# Altium project zynq_dev_V1.PrjPcb (part 1 of 3)
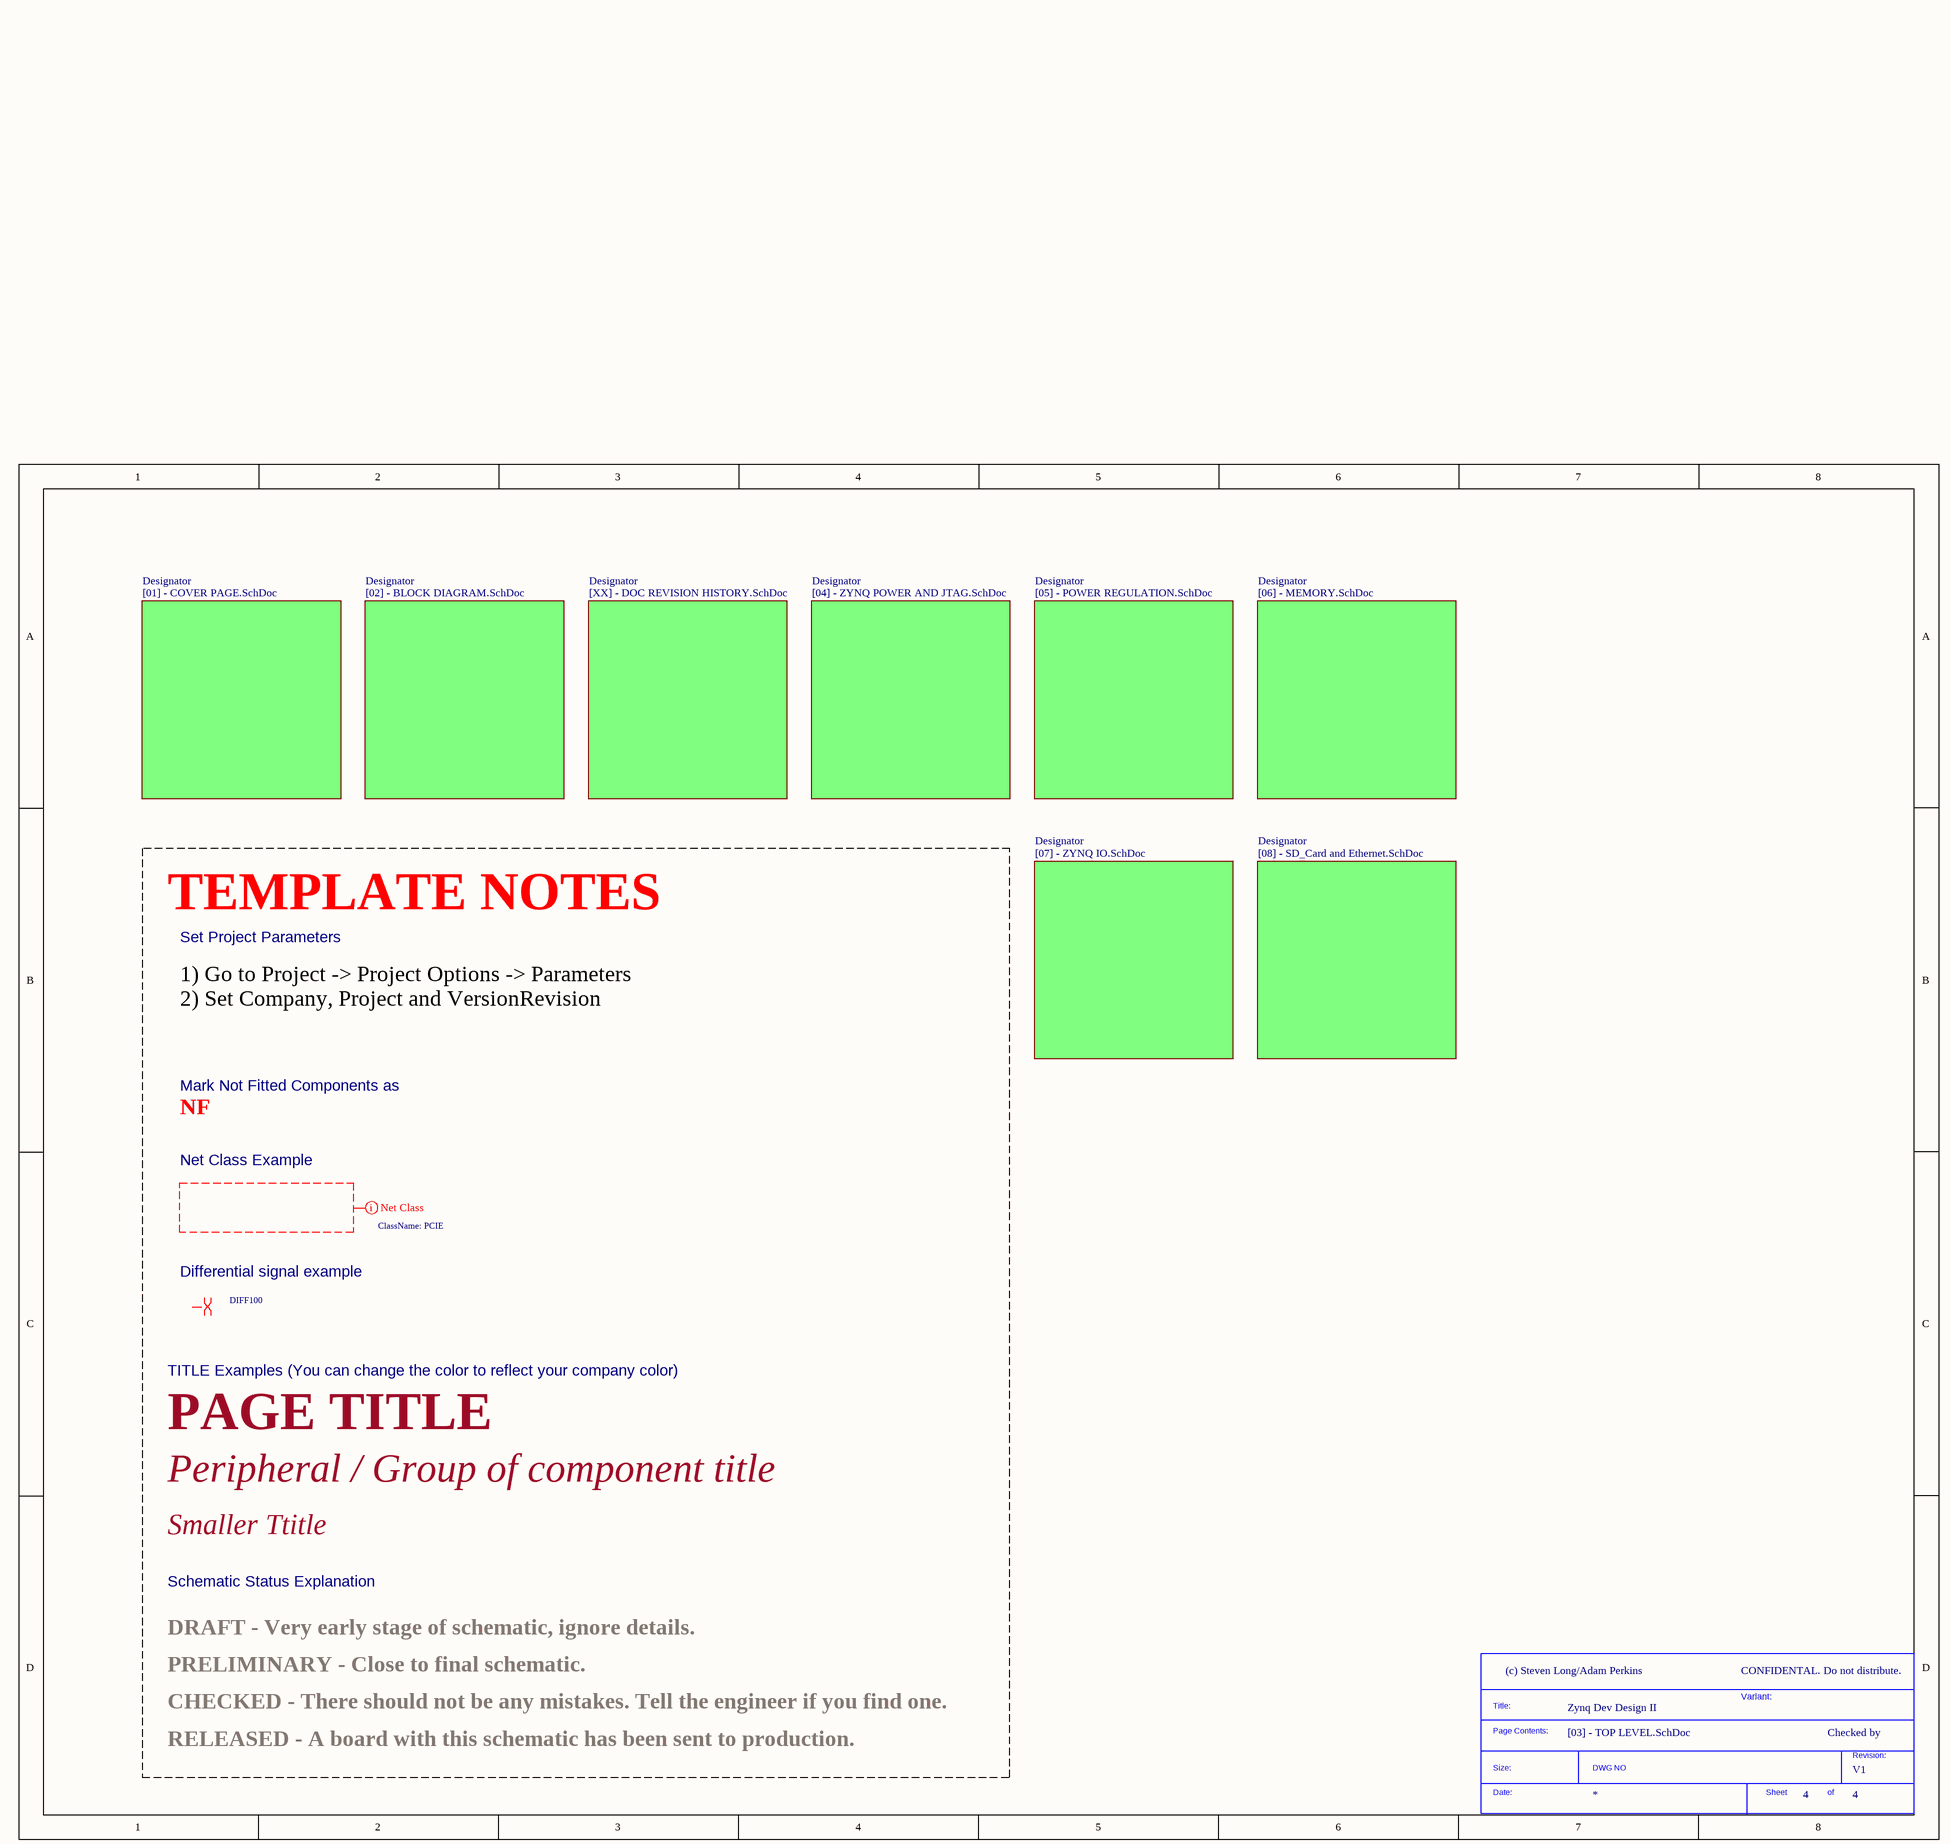
[diagram p0: [03] - TOP LEVEL.SchDoc]
VersionRevision: V1; Project: Zynq Dev Design II; Company: (c) Steven Long/Adam Perkins
8 sheets, 321 parts. Net scope: flat (ports and power ports of the same name join across sheets).
Board file: zynq_dev_V1.PcbDoc
Sheets:
  [03] - TOP LEVEL.SchDoc
    Designator = [01] - COVER PAGE.SchDoc
    Designator = [02] - BLOCK DIAGRAM.SchDoc
    Designator = [04] - ZYNQ POWER AND JTAG.SchDoc
    Designator = [05] - POWER REGULATION.SchDoc
    Designator = [06] - MEMORY.SchDoc
    Designator = [07] - ZYNQ IO.SchDoc
    Designator = [08] - SD_Card and Ethernet.SchDoc

## Sheet [03] - TOP LEVEL.SchDoc
size A3; CompanyName: KDS; Organization: KDS; DocumentNumber: 4; Revision: V1I1; SheetNumber: 4; SheetTotal: 4; PageSetup: Record=PageOptions|CenterHorizontal=True|CenterVertical=True|PrintScale=1.07|XCorrection=1.00|YCorrection=1.00|PrintKind=1|BorderSize=5000000|LeftOffset=0|BottomOffset=0|Orientation=2|PaperLength=1000|PaperWidth=1000|Scale=100|PaperSource=7|PrintQuality=600|MediaType=1|DitherType=10|PaperKind=A3|PrintScaleMode=1; ProjectName: KDS C6A816x Module

### Parts
(Parts that share a designator on the sheet are numbered #1, #2 ... from top to bottom, then left to right.)
*#1  SDTitleBlock  (value not drawn)  (graphical)

### Sub-sheets
Designator = [01] - COVER PAGE.SchDoc: no entries
Designator = [02] - BLOCK DIAGRAM.SchDoc: no entries
Designator = [XX] - DOC REVISION HISTORY.SchDoc (file not in this document): no entries
Designator = [04] - ZYNQ POWER AND JTAG.SchDoc: no entries
Designator = [05] - POWER REGULATION.SchDoc: no entries
Designator = [06] - MEMORY.SchDoc: no entries
Designator = [07] - ZYNQ IO.SchDoc: no entries
Designator = [08] - SD_Card and Ethernet.SchDoc: no entries

### Layout directives
net class PCIE: (no net found under the mark)
differential pair; net class DIFF100: (no net found under the mark)

### Notes on the sheet
- TEMPLATE NOTES
- Set Project Parameters
- 1) Go to Project -> Project Options -> Parameters
  2) Set Company, Project and VersionRevision
- NF
- Mark Not Fitted Components as
- Net Class Example
- Differential signal example
- TITLE Examples (You can change the color to reflect your company color)
- PAGE TITLE
- Peripheral / Group of component title
- Smaller Ttitle
- Schematic Status Explanation
- PRELIMINARY - Close to final schematic.
- DRAFT - Very early stage of schematic, ignore details.
- CONFIDENTAL. Do not distribute.
- CHECKED - There should not be any mistakes. Tell the engineer if you find one.
- Variant:
- Checked by
- RELEASED - A board with this schematic has been sent to production.
- (in symbol SDTitleBlock) Title:; Page Contents:; Revision:; Size:; DWG NO; Date:; Sheet; of

## Sheet [01] - COVER PAGE.SchDoc
size A3; DocumentNumber: 1; SheetNumber: 1; SheetTotal: 4
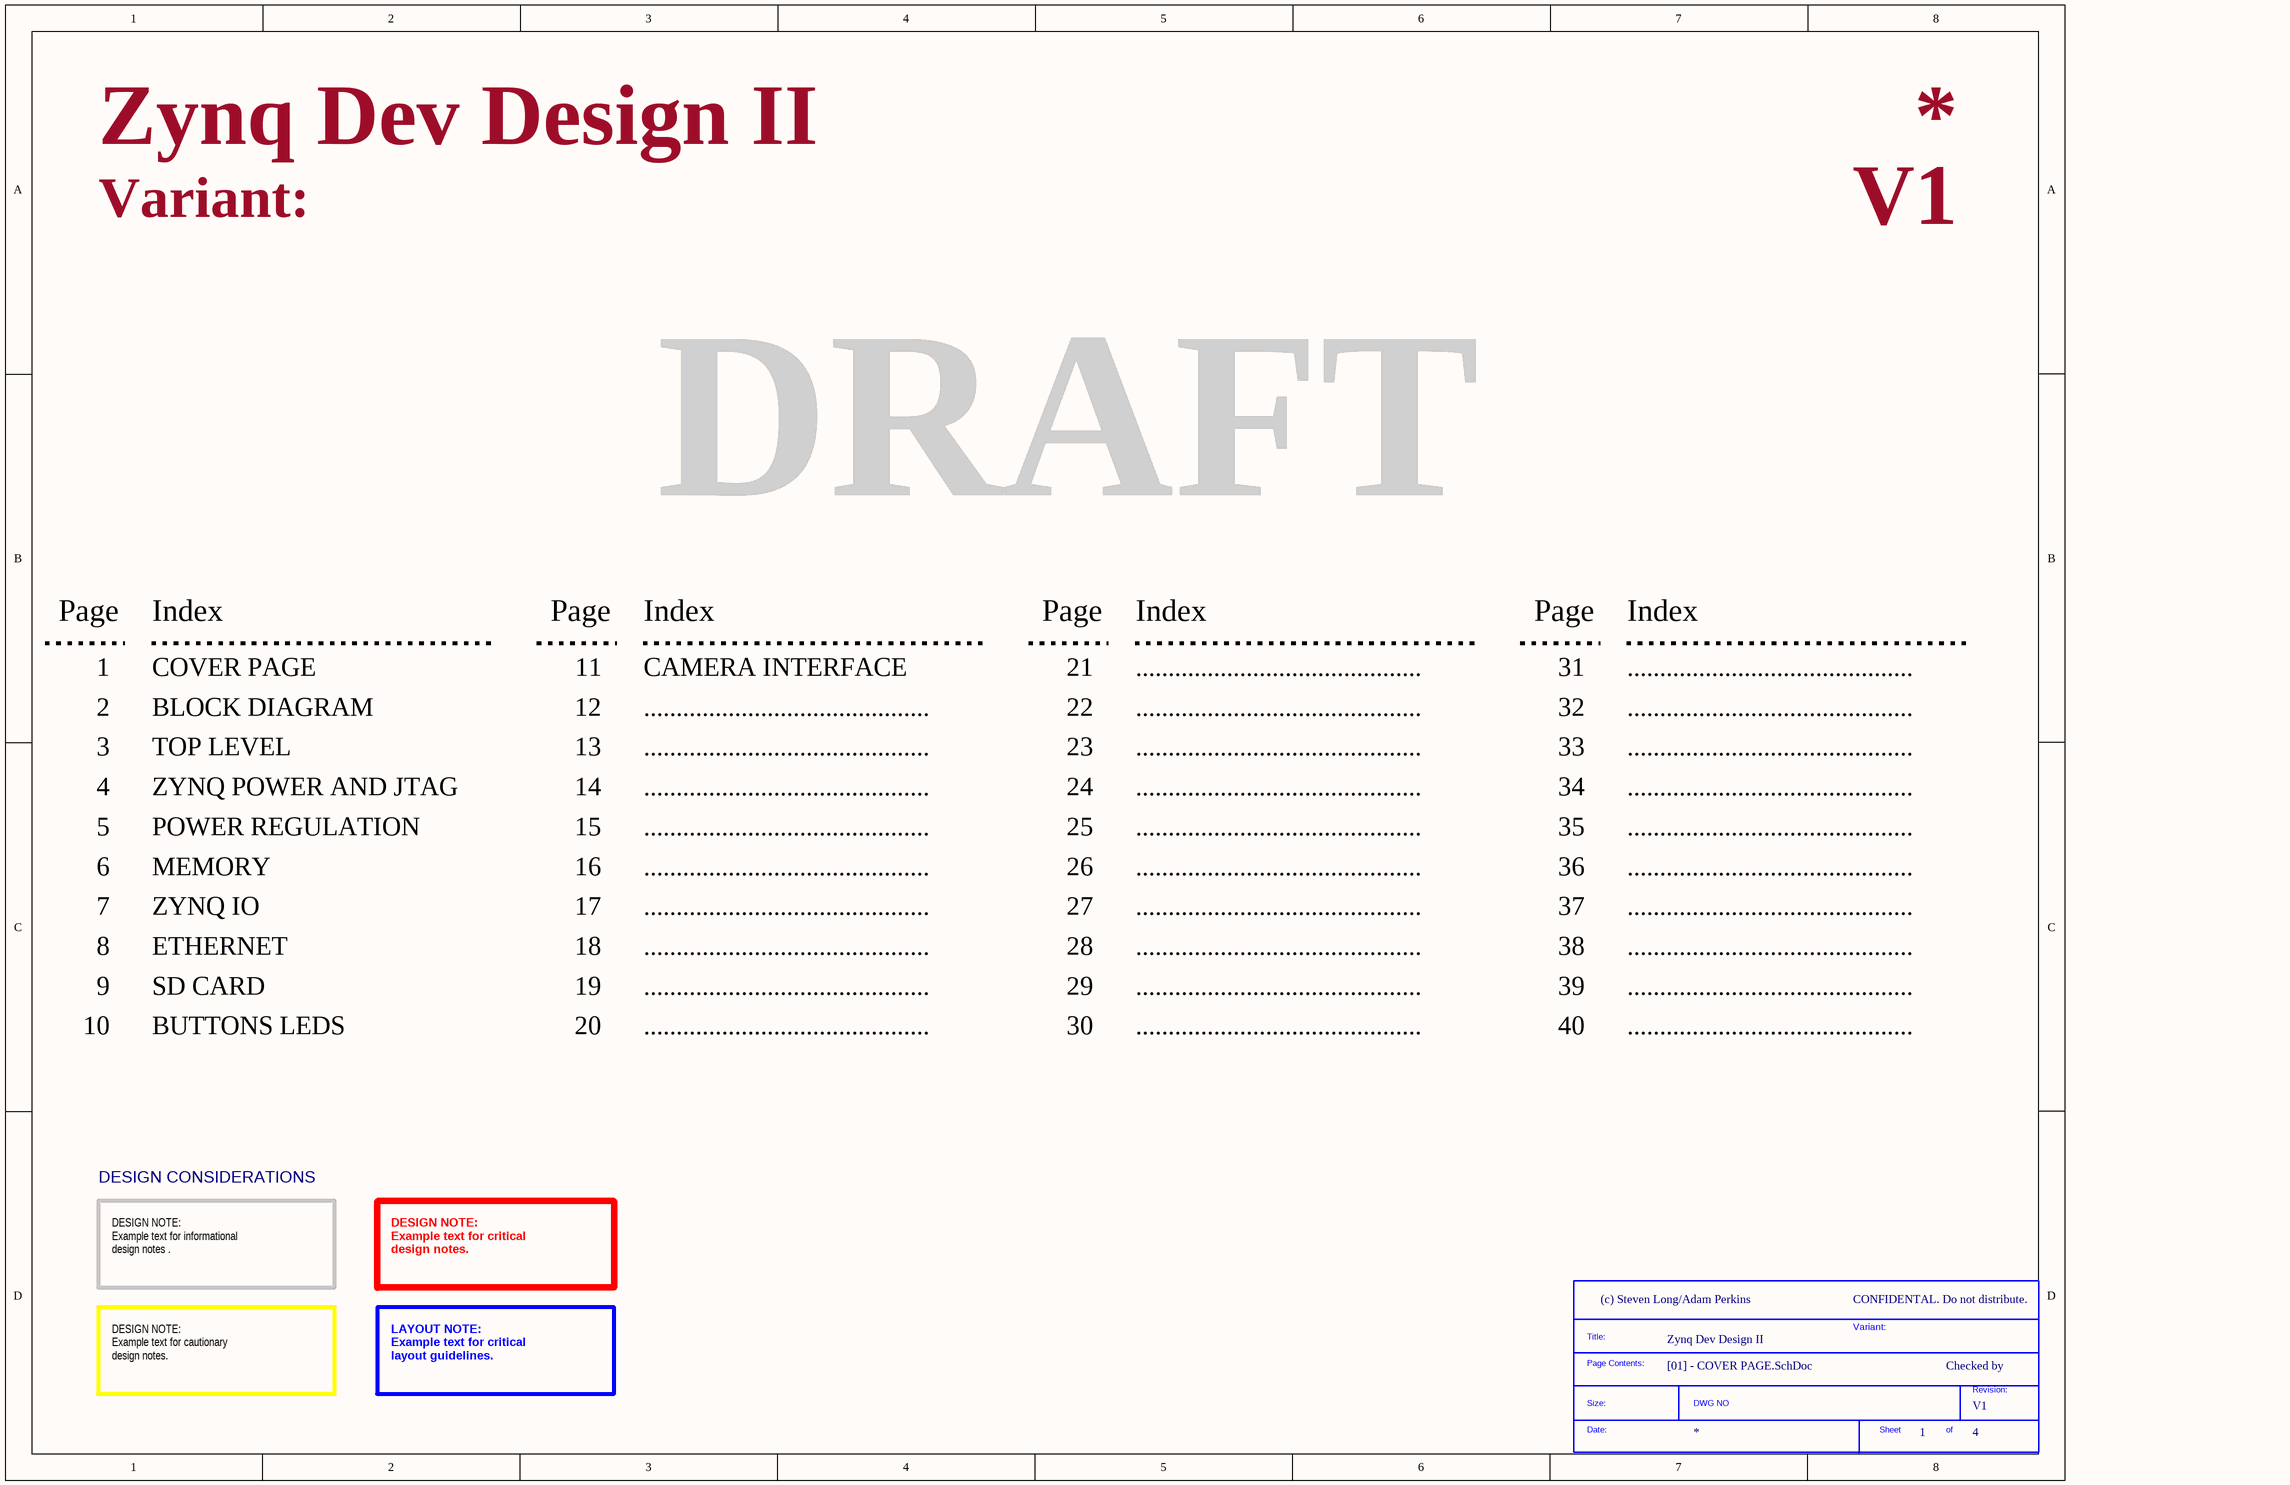
[diagram p1: [01] - COVER PAGE.SchDoc]

### Parts
(Parts that share a designator on the sheet are numbered #1, #2 ... from top to bottom, then left to right.)
*#2  SDTitleBlock  (value not drawn)  (graphical)

### Notes on the sheet
- Variant:
- DRAFT
- Page
- Index
- 1
- COVER PAGE
- 11
- CAMERA INTERFACE
- 21
- ............................................
- 31
- 2
- 3
- BLOCK DIAGRAM
- TOP LEVEL
- 12
- 13
- 22
- 23
- 32
- 33
- 4
- 5
- ZYNQ POWER AND JTAG
- POWER REGULATION
- 14
- 15
- 24
- 25
- 34
- 35
- 6
- MEMORY
- 16
- 26
- 36
- 7
- 8
- ZYNQ IO
- ETHERNET
- 17
- 18
- 27
- 28
- 37
- 38
- 9
- 10
- SD CARD
- BUTTONS LEDS
- 19
- 20
- 29
- 30
- 39
- 40
- DESIGN CONSIDERATIONS
- DESIGN NOTE:
  Example text for informational
  design notes .
- DESIGN NOTE:
  Example text for critical
  design notes.
- CONFIDENTAL. Do not distribute.
- Checked by
- DESIGN NOTE:
  Example text for cautionary
  design notes.
- LAYOUT NOTE:
  Example text for critical
  layout guidelines.
- (in symbol SDTitleBlock) Title:; Page Contents:; Revision:; Size:; DWG NO; Date:; Sheet; of

## Sheet [02] - BLOCK DIAGRAM.SchDoc
size A2; DocumentNumber: 2; SheetNumber: 2; SheetTotal: 4
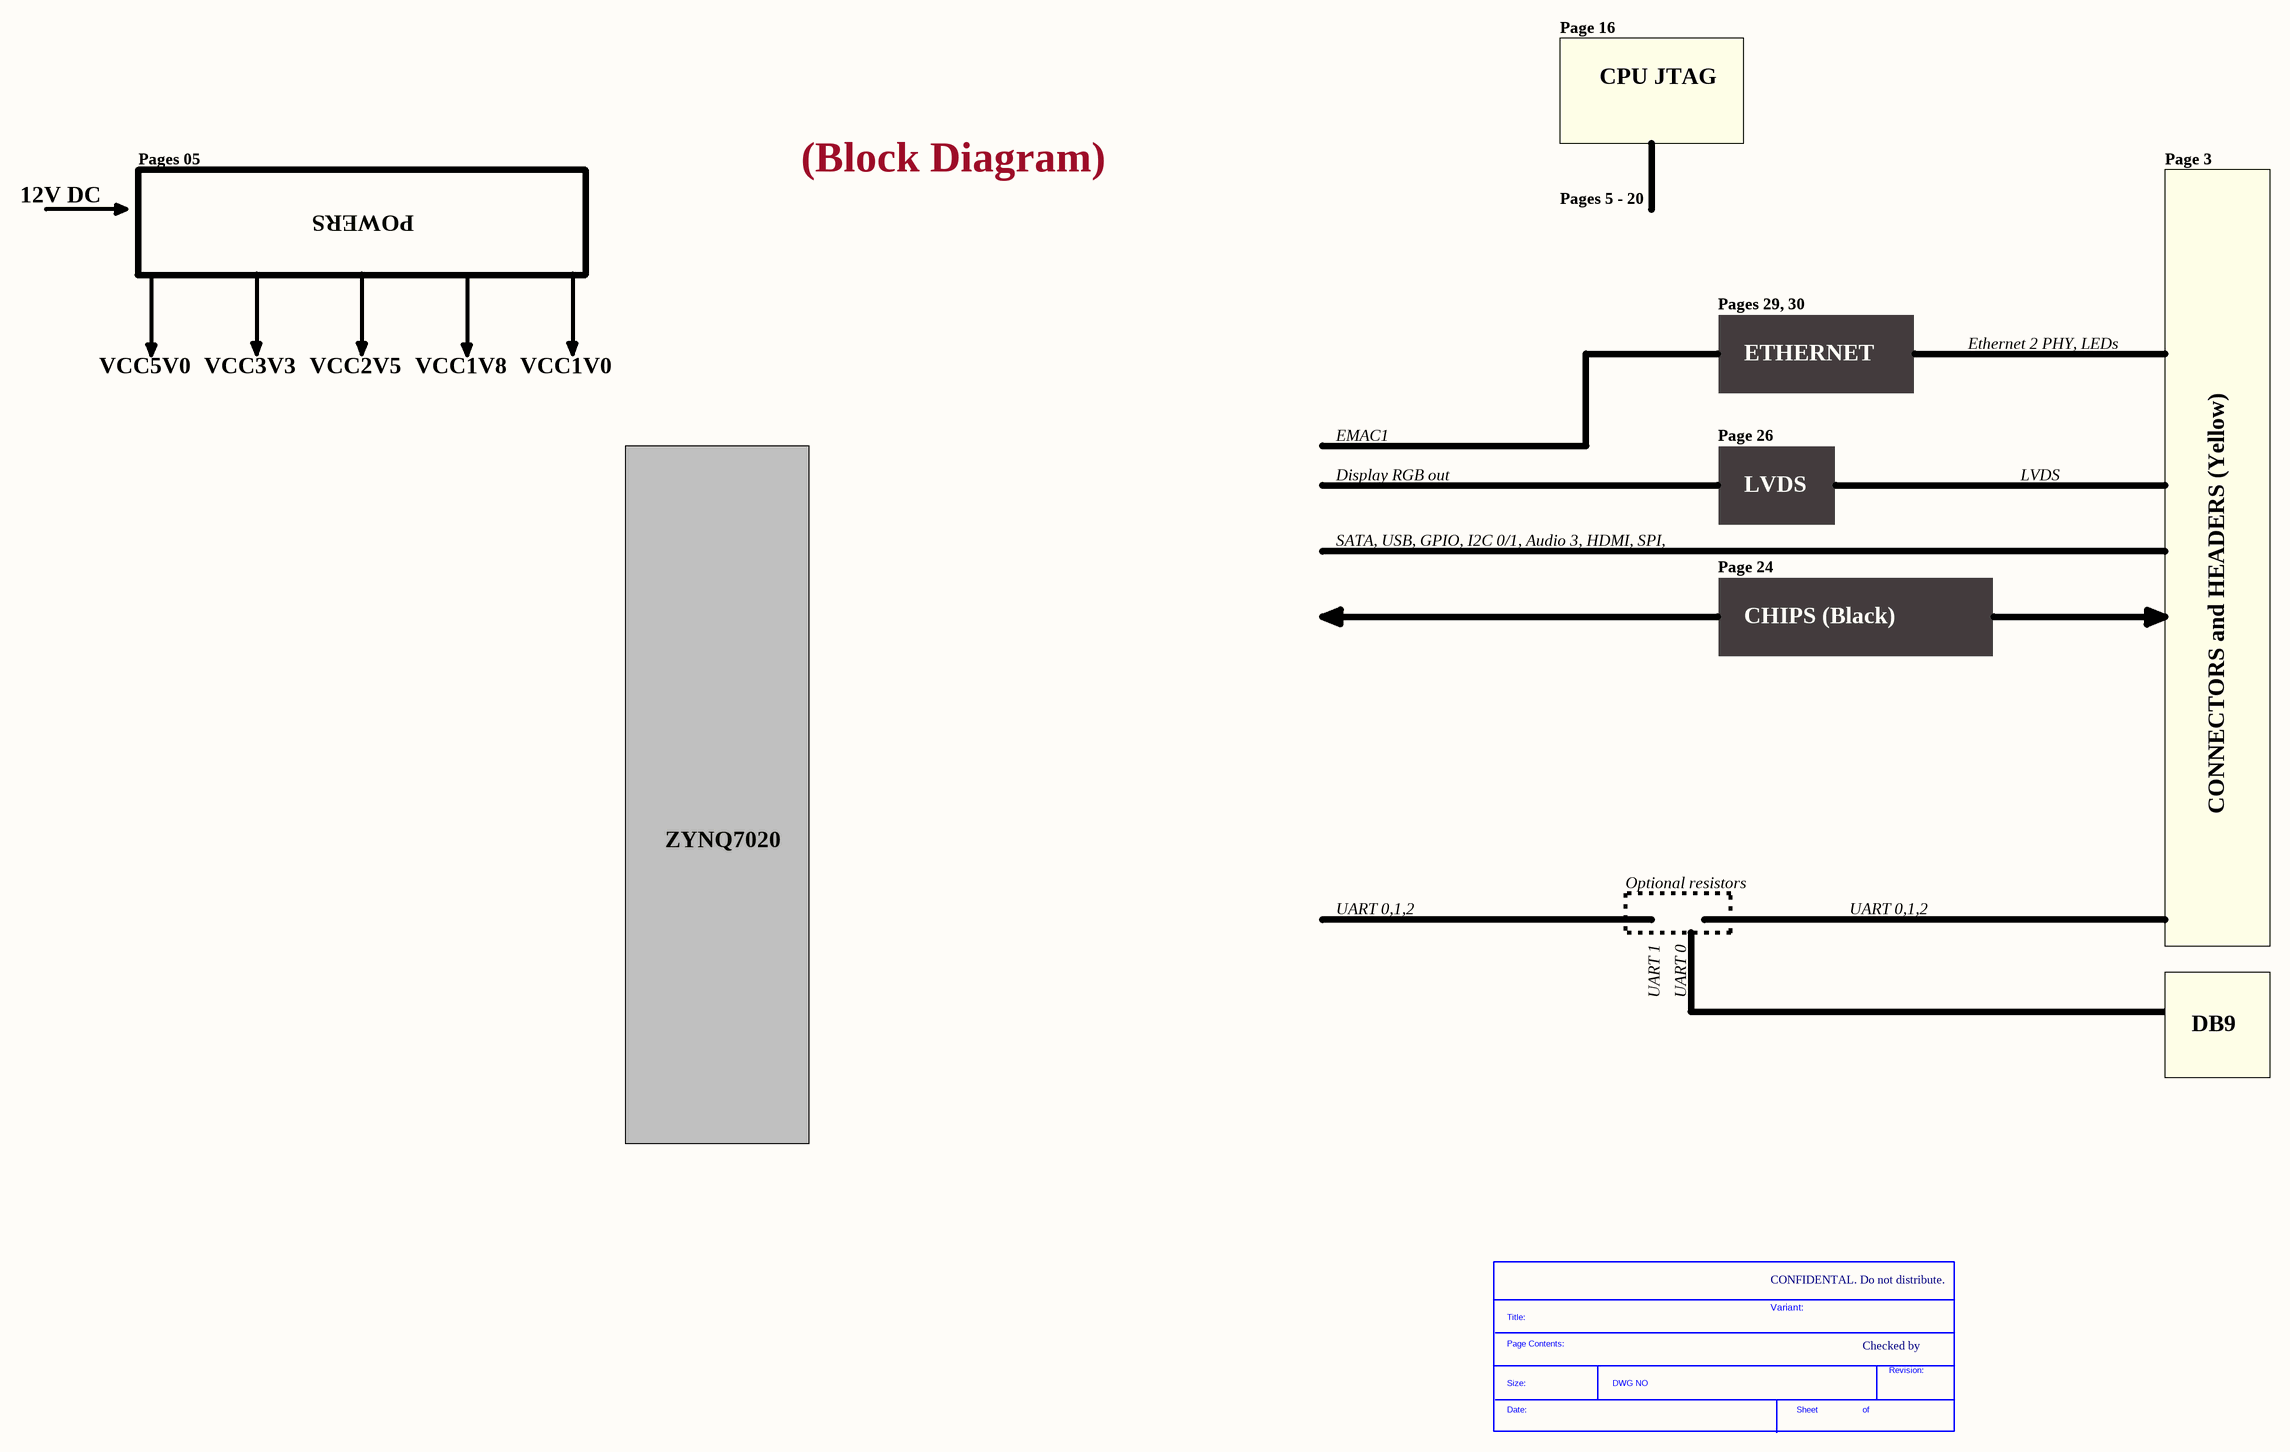
[diagram p2: [02] - BLOCK DIAGRAM.SchDoc]

### Parts
(Parts that share a designator on the sheet are numbered #1, #2 ... from top to bottom, then left to right.)
*#3  SDTitleBlock  (value not drawn)  (graphical)

### Notes on the sheet
- Page 16
- CPU JTAG
- Pages 05
- Page 3
- 12V DC
- POWERS
- (Block Diagram)
- Pages 5 - 20
- Pages 29, 30
- ETHERNET
- Ethernet 2 PHY, LEDs
- VCC5V0
- VCC3V3
- VCC2V5
- VCC1V8
- VCC1V0
- Display RGB out
- EMAC1
- Page 26
- LVDS
- SATA, USB, GPIO, I2C 0/1, Audio 3, HDMI, SPI,
- Page 24
- CHIPS (Black)
- CONNECTORS and HEADERS (Yellow)
- ZYNQ7020
- Optional resistors
- UART 0,1,2
- FPGA
- UART 1
- UART 0
- DB9
- CONFIDENTAL. Do not distribute.
- CLOCKS (CPU & PCIE)
- Variant:
- Checked by
- (in symbol SDTitleBlock) Title:; Page Contents:; Revision:; Size:; DWG NO; Date:; Sheet; of

## Sheet [04] - ZYNQ POWER AND JTAG.SchDoc
size A3; DocumentNumber: 3; SheetNumber: 3; SheetTotal: 4
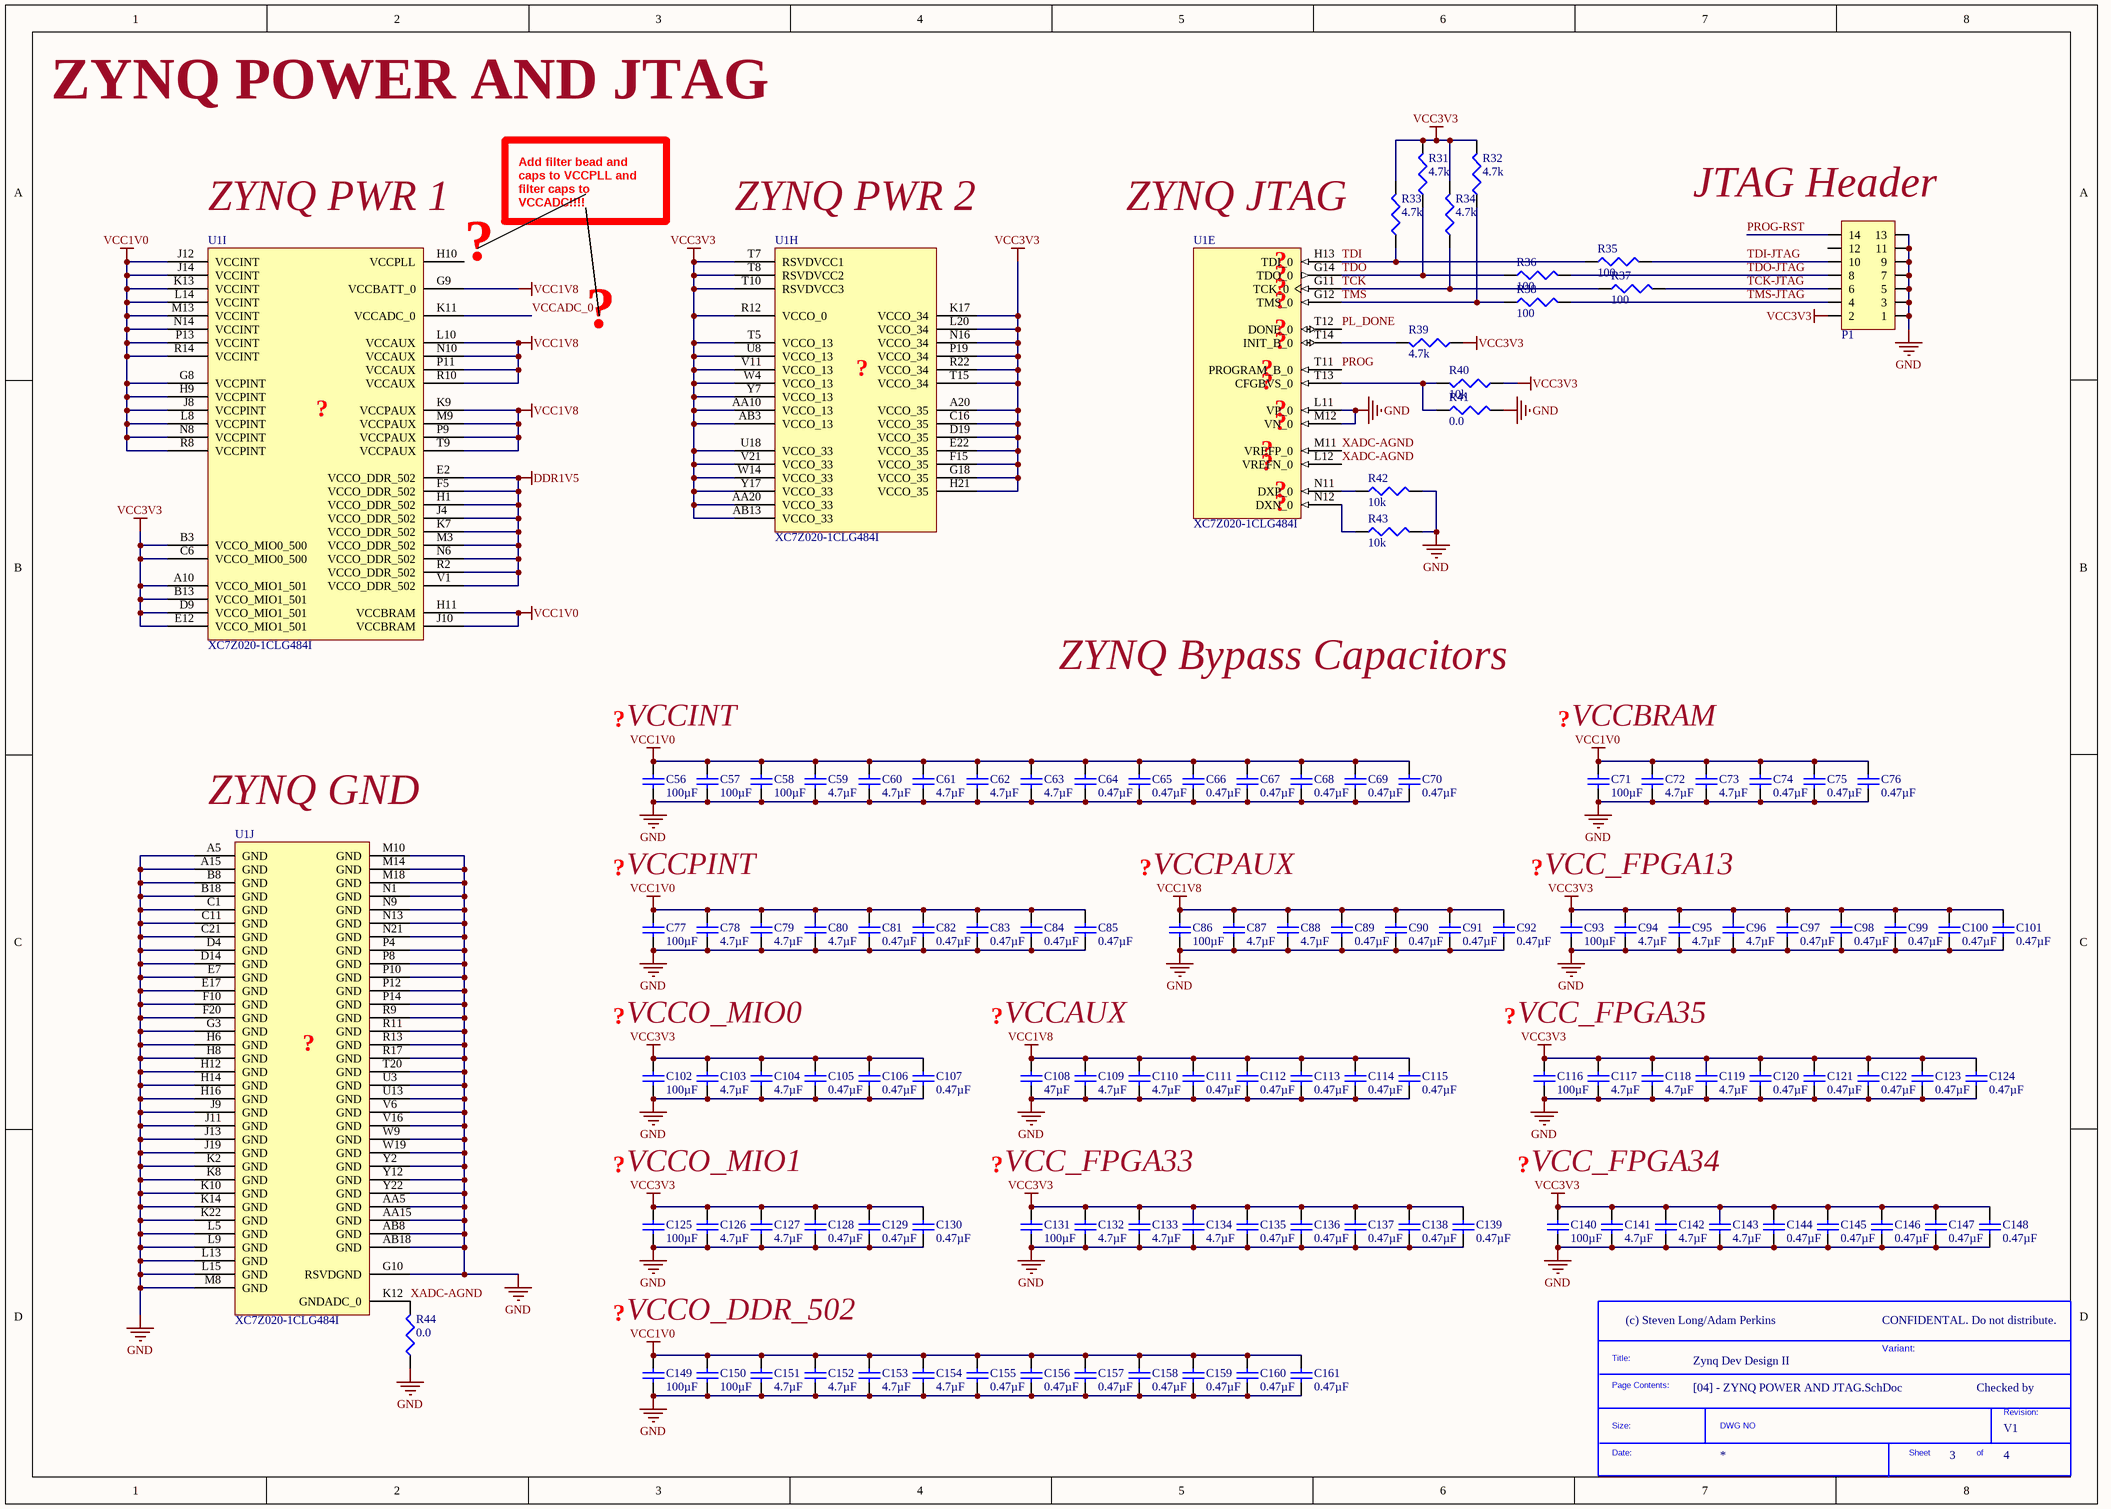
[diagram p3: [04] - ZYNQ POWER AND JTAG.SchDoc]

### Parts
(Parts that share a designator on the sheet are numbered #1, #2 ... from top to bottom, then left to right.)
*#4  SDTitleBlock  (value not drawn)  (graphical)
C56  Capacitance: 100µF  [CAP-1210]  (hidden comment: GRM32EE70G107ME19L)
C57  Capacitance: 100µF  [CAP-1210]  (hidden comment: GRM32EE70G107ME19L)
C58  Capacitance: 100µF  [CAP-1210]  (hidden comment: GRM32EE70G107ME19L)
C59  Capacitance: 4.7µF  [CAP-0603]  (hidden comment: GRM188R60J475KE19D)
C60  Capacitance: 4.7µF  [CAP-0603]  (hidden comment: GRM188R60J475KE19D)
C61  Capacitance: 4.7µF  [CAP-0603]  (hidden comment: GRM188R60J475KE19D)
C62  Capacitance: 4.7µF  [CAP-0603]  (hidden comment: GRM188R60J475KE19D)
C63  Capacitance: 4.7µF  [CAP-0603]  (hidden comment: GRM188R60J475KE19D)
C64  Capacitance: 0.47µF  [CAP-0402]  (hidden comment: C1005X7S1A474K050BC)
C65  Capacitance: 0.47µF  [CAP-0402]  (hidden comment: C1005X7S1A474K050BC)
C66  Capacitance: 0.47µF  [CAP-0402]  (hidden comment: C1005X7S1A474K050BC)
C67  Capacitance: 0.47µF  [CAP-0402]  (hidden comment: C1005X7S1A474K050BC)
C68  Capacitance: 0.47µF  [CAP-0402]  (hidden comment: C1005X7S1A474K050BC)
C69  Capacitance: 0.47µF  [CAP-0402]  (hidden comment: C1005X7S1A474K050BC)
C70  Capacitance: 0.47µF  [CAP-0402]  (hidden comment: C1005X7S1A474K050BC)
C71  Capacitance: 100µF  [CAP-1210]  (hidden comment: GRM32EE70G107ME19L)
C72  Capacitance: 4.7µF  [CAP-0603]  (hidden comment: GRM188R60J475KE19D)
C73  Capacitance: 4.7µF  [CAP-0603]  (hidden comment: GRM188R60J475KE19D)
C74  Capacitance: 0.47µF  [CAP-0402]  (hidden comment: C1005X7S1A474K050BC)
C75  Capacitance: 0.47µF  [CAP-0402]  (hidden comment: C1005X7S1A474K050BC)
C76  Capacitance: 0.47µF  [CAP-0402]  (hidden comment: C1005X7S1A474K050BC)
C77  Capacitance: 100µF  [CAP-1210]  (hidden comment: GRM32EE70G107ME19L)
C78  Capacitance: 4.7µF  [CAP-0603]  (hidden comment: GRM188R60J475KE19D)
C79  Capacitance: 4.7µF  [CAP-0603]  (hidden comment: GRM188R60J475KE19D)
C80  Capacitance: 4.7µF  [CAP-0603]  (hidden comment: GRM188R60J475KE19D)
C81  Capacitance: 0.47µF  [CAP-0402]  (hidden comment: C1005X7S1A474K050BC)
C82  Capacitance: 0.47µF  [CAP-0402]  (hidden comment: C1005X7S1A474K050BC)
C83  Capacitance: 0.47µF  [CAP-0402]  (hidden comment: C1005X7S1A474K050BC)
C84  Capacitance: 0.47µF  [CAP-0402]  (hidden comment: C1005X7S1A474K050BC)
C85  Capacitance: 0.47µF  [CAP-0402]  (hidden comment: C1005X7S1A474K050BC)
C86  Capacitance: 100µF  [CAP-1210]  (hidden comment: GRM32EE70G107ME19L)
C87  Capacitance: 4.7µF  [CAP-0603]  (hidden comment: GRM188R60J475KE19D)
C88  Capacitance: 4.7µF  [CAP-0603]  (hidden comment: GRM188R60J475KE19D)
C89  Capacitance: 0.47µF  [CAP-0402]  (hidden comment: C1005X7S1A474K050BC)
C90  Capacitance: 0.47µF  [CAP-0402]  (hidden comment: C1005X7S1A474K050BC)
C91  Capacitance: 0.47µF  [CAP-0402]  (hidden comment: C1005X7S1A474K050BC)
C92  Capacitance: 0.47µF  [CAP-0402]  (hidden comment: C1005X7S1A474K050BC)
C93  Capacitance: 100µF  [CAP-1210]  (hidden comment: GRM32EE70G107ME19L)
C94  Capacitance: 4.7µF  [CAP-0603]  (hidden comment: GRM188R60J475KE19D)
C95  Capacitance: 4.7µF  [CAP-0603]  (hidden comment: GRM188R60J475KE19D)
C96  Capacitance: 4.7µF  [CAP-0603]  (hidden comment: GRM188R60J475KE19D)
C97  Capacitance: 0.47µF  [CAP-0402]  (hidden comment: C1005X7S1A474K050BC)
C98  Capacitance: 0.47µF  [CAP-0402]  (hidden comment: C1005X7S1A474K050BC)
C99  Capacitance: 0.47µF  [CAP-0402]  (hidden comment: C1005X7S1A474K050BC)
C100  Capacitance: 0.47µF  [CAP-0402]  (hidden comment: C1005X7S1A474K050BC)
C101  Capacitance: 0.47µF  [CAP-0402]  (hidden comment: C1005X7S1A474K050BC)
C102  Capacitance: 100µF  [CAP-1210]  (hidden comment: GRM32EE70G107ME19L)
C103  Capacitance: 4.7µF  [CAP-0603]  (hidden comment: GRM188R60J475KE19D)
C104  Capacitance: 4.7µF  [CAP-0603]  (hidden comment: GRM188R60J475KE19D)
C105  Capacitance: 0.47µF  [CAP-0402]  (hidden comment: C1005X7S1A474K050BC)
C106  Capacitance: 0.47µF  [CAP-0402]  (hidden comment: C1005X7S1A474K050BC)
C107  Capacitance: 0.47µF  [CAP-0402]  (hidden comment: C1005X7S1A474K050BC)
C108  Capacitance: 47µF  [CAP-1210]  (hidden comment: GRM32ER61C476ME15L)
C109  Capacitance: 4.7µF  [CAP-0603]  (hidden comment: GRM188R60J475KE19D)
C110  Capacitance: 4.7µF  [CAP-0603]  (hidden comment: GRM188R60J475KE19D)
C111  Capacitance: 0.47µF  [CAP-0402]  (hidden comment: C1005X7S1A474K050BC)
C112  Capacitance: 0.47µF  [CAP-0402]  (hidden comment: C1005X7S1A474K050BC)
C113  Capacitance: 0.47µF  [CAP-0402]  (hidden comment: C1005X7S1A474K050BC)
C114  Capacitance: 0.47µF  [CAP-0402]  (hidden comment: C1005X7S1A474K050BC)
C115  Capacitance: 0.47µF  [CAP-0402]  (hidden comment: C1005X7S1A474K050BC)
C116  Capacitance: 100µF  [CAP-1210]  (hidden comment: GRM32EE70G107ME19L)
C117  Capacitance: 4.7µF  [CAP-0603]  (hidden comment: GRM188R60J475KE19D)
C118  Capacitance: 4.7µF  [CAP-0603]  (hidden comment: GRM188R60J475KE19D)
C119  Capacitance: 4.7µF  [CAP-0603]  (hidden comment: GRM188R60J475KE19D)
C120  Capacitance: 0.47µF  [CAP-0402]  (hidden comment: C1005X7S1A474K050BC)
C121  Capacitance: 0.47µF  [CAP-0402]  (hidden comment: C1005X7S1A474K050BC)
C122  Capacitance: 0.47µF  [CAP-0402]  (hidden comment: C1005X7S1A474K050BC)
C123  Capacitance: 0.47µF  [CAP-0402]  (hidden comment: C1005X7S1A474K050BC)
C124  Capacitance: 0.47µF  [CAP-0402]  (hidden comment: C1005X7S1A474K050BC)
C125  Capacitance: 100µF  [CAP-1210]  (hidden comment: GRM32EE70G107ME19L)
C126  Capacitance: 4.7µF  [CAP-0603]  (hidden comment: GRM188R60J475KE19D)
C127  Capacitance: 4.7µF  [CAP-0603]  (hidden comment: GRM188R60J475KE19D)
C128  Capacitance: 0.47µF  [CAP-0402]  (hidden comment: C1005X7S1A474K050BC)
C129  Capacitance: 0.47µF  [CAP-0402]  (hidden comment: C1005X7S1A474K050BC)
C130  Capacitance: 0.47µF  [CAP-0402]  (hidden comment: C1005X7S1A474K050BC)
C131  Capacitance: 100µF  [CAP-1210]  (hidden comment: GRM32EE70G107ME19L)
C132  Capacitance: 4.7µF  [CAP-0603]  (hidden comment: GRM188R60J475KE19D)
C133  Capacitance: 4.7µF  [CAP-0603]  (hidden comment: GRM188R60J475KE19D)
C134  Capacitance: 4.7µF  [CAP-0603]  (hidden comment: GRM188R60J475KE19D)
C135  Capacitance: 0.47µF  [CAP-0402]  (hidden comment: C1005X7S1A474K050BC)
C136  Capacitance: 0.47µF  [CAP-0402]  (hidden comment: C1005X7S1A474K050BC)
C137  Capacitance: 0.47µF  [CAP-0402]  (hidden comment: C1005X7S1A474K050BC)
C138  Capacitance: 0.47µF  [CAP-0402]  (hidden comment: C1005X7S1A474K050BC)
C139  Capacitance: 0.47µF  [CAP-0402]  (hidden comment: C1005X7S1A474K050BC)
C140  Capacitance: 100µF  [CAP-1210]  (hidden comment: GRM32EE70G107ME19L)
C141  Capacitance: 4.7µF  [CAP-0603]  (hidden comment: GRM188R60J475KE19D)
C142  Capacitance: 4.7µF  [CAP-0603]  (hidden comment: GRM188R60J475KE19D)
C143  Capacitance: 4.7µF  [CAP-0603]  (hidden comment: GRM188R60J475KE19D)
C144  Capacitance: 0.47µF  [CAP-0402]  (hidden comment: C1005X7S1A474K050BC)
C145  Capacitance: 0.47µF  [CAP-0402]  (hidden comment: C1005X7S1A474K050BC)
C146  Capacitance: 0.47µF  [CAP-0402]  (hidden comment: C1005X7S1A474K050BC)
C147  Capacitance: 0.47µF  [CAP-0402]  (hidden comment: C1005X7S1A474K050BC)
C148  Capacitance: 0.47µF  [CAP-0402]  (hidden comment: C1005X7S1A474K050BC)
C149  Capacitance: 100µF  [CAP-1210]  (hidden comment: GRM32EE70G107ME19L)
C150  Capacitance: 100µF  [CAP-1210]  (hidden comment: GRM32EE70G107ME19L)
C151  Capacitance: 4.7µF  [CAP-0603]  (hidden comment: GRM188R60J475KE19D)
C152  Capacitance: 4.7µF  [CAP-0603]  (hidden comment: GRM188R60J475KE19D)
C153  Capacitance: 4.7µF  [CAP-0603]  (hidden comment: GRM188R60J475KE19D)
C154  Capacitance: 4.7µF  [CAP-0603]  (hidden comment: GRM188R60J475KE19D)
C155  Capacitance: 0.47µF  [CAP-0402]  (hidden comment: C1005X7S1A474K050BC)
C156  Capacitance: 0.47µF  [CAP-0402]  (hidden comment: C1005X7S1A474K050BC)
C157  Capacitance: 0.47µF  [CAP-0402]  (hidden comment: C1005X7S1A474K050BC)
C158  Capacitance: 0.47µF  [CAP-0402]  (hidden comment: C1005X7S1A474K050BC)
C159  Capacitance: 0.47µF  [CAP-0402]  (hidden comment: C1005X7S1A474K050BC)
C160  Capacitance: 0.47µF  [CAP-0402]  (hidden comment: C1005X7S1A474K050BC)
C161  Capacitance: 0.47µF  [CAP-0402]  (hidden comment: C1005X7S1A474K050BC)
P1  0878311420  [87831-1420]  (value not drawn)
R31  Resistance (Ohms): 4.7k  [R0603]  (hidden comment: ERJ-3EKF4701V)
R32  Resistance (Ohms): 4.7k  [R0603]  (hidden comment: ERJ-3EKF4701V)
R33  Resistance (Ohms): 4.7k  [R0603]  (hidden comment: ERJ-3EKF4701V)
R34  Resistance (Ohms): 4.7k  [R0603]  (hidden comment: ERJ-3EKF4701V)
R35  Resistance (Ohms): 100  [R0603]  (hidden comment: RC0603FR-07100RL)
R36  Resistance (Ohms): 100  [R0603]  (hidden comment: RC0603FR-07100RL)
R37  Resistance (Ohms): 100  [R0603]  (hidden comment: RC0603FR-07100RL)
R38  Resistance (Ohms): 100  [R0603]  (hidden comment: RC0603FR-07100RL)
R39  Resistance (Ohms): 4.7k  [R0603]  (hidden comment: ERJ-3EKF4701V)
R40  Resistance (Ohms): 10k  [R0603]  (hidden comment: RC0603FR-0710KL)
R41  Resistance (Ohms): 0.0  [R0603]  (hidden comment: ERJ-3GEY0R00V)
R42  Resistance (Ohms): 10k  [R0603]  (hidden comment: RC0603FR-0710KL)
R43  Resistance (Ohms): 10k  [R0603]  (hidden comment: RC0603FR-0710KL)
R44  Resistance (Ohms): 0.0  [R0603]  (hidden comment: ERJ-3GEY0R00V)
U1  XC7Z020-1CLG484I  [CLG484]  (parts E,H,I,J of 10)

### Nets
DDR1V5: U1.E2(VCCO_DDR_502) U1.F5(VCCO_DDR_502) U1.H1(VCCO_DDR_502) U1.J4(VCCO_DDR_502) U1.K7(VCCO_DDR_502) U1.M3(VCCO_DDR_502) U1.N6(VCCO_DDR_502) U1.R2(VCCO_DDR_502) U1.V1(VCCO_DDR_502)
GND: C56.2 C57.2 C58.2 C59.2 C60.2 C61.2 C62.2 C63.2 C64.2 C65.2 C66.2 C67.2 C68.2 C69.2 C70.2 C71.2 C72.2 C73.2 C74.2 C75.2 C76.2 C77.2 C78.2 C79.2 C80.2 C81.2 C82.2 C83.2 C84.2 C85.2 C86.2 C87.2 C88.2 C89.2 C90.2 C91.2 C92.2 C93.2 C94.2 C95.2 C96.2 C97.2 C98.2 C99.2 C100.2 C101.2 C102.2 C103.2 C104.2 C105.2 C106.2 C107.2 C108.2 C109.2 C110.2 C111.2 C112.2 C113.2 C114.2 C115.2 C116.2 C117.2 C118.2 C119.2 C120.2 C121.2 C122.2 C123.2 C124.2 C125.2 C126.2 C127.2 C128.2 C129.2 C130.2 C131.2 C132.2 C133.2 C134.2 C135.2 C136.2 C137.2 C138.2 C139.2 C140.2 C141.2 C142.2 C143.2 C144.2 C145.2 C146.2 C147.2 C148.2 C149.2 C150.2 C151.2 C152.2 C153.2 C154.2 C155.2 C156.2 C157.2 C158.2 C159.2 C160.2 C161.2 P1.1 P1.3 P1.5 P1.7 P1.9 P1.11 P1.13 R41.2 R42.2 R43.2 R44.1 U1.A5(GND) U1.A15(GND) U1.AA5(GND) U1.AA15(GND) U1.AB8(GND) U1.AB18(GND) U1.B8(GND) U1.B18(GND) U1.C1(GND) U1.C11(GND) U1.C21(GND) U1.D4(GND) U1.D14(GND) U1.E7(GND) U1.E17(GND) U1.F10(GND) U1.F20(GND) U1.G3(GND) U1.G10(RSVDGND) U1.H6(GND) U1.H8(GND) U1.H12(GND) U1.H14(GND) U1.H16(GND) U1.J9(GND) U1.J11(GND) U1.J13(GND) U1.J19(GND) U1.K2(GND) U1.K8(GND) U1.K10(GND) U1.K14(GND) U1.K22(GND) U1.L5(GND) U1.L9(GND) U1.L11(VP_0) U1.L13(GND) U1.L15(GND) U1.M8(GND) U1.M10(GND) U1.M12(VN_0) U1.M14(GND) U1.M18(GND) U1.N1(GND) U1.N9(GND) U1.N13(GND) U1.N21(GND) U1.P4(GND) U1.P8(GND) U1.P10(GND) U1.P12(GND) U1.P14(GND) U1.R9(GND) U1.R11(GND) U1.R13(GND) U1.R17(GND) U1.T20(GND) U1.U3(GND) U1.U13(GND) U1.V6(GND) U1.V16(GND) U1.W9(GND) U1.W19(GND) U1.Y2(GND) U1.Y12(GND) U1.Y22(GND)
VCC1V0: C56.1 C57.1 C58.1 C59.1 C60.1 C61.1 C62.1 C63.1 C64.1 C65.1 C66.1 C67.1 C68.1 C69.1 C70.1 C71.1 C72.1 C73.1 C74.1 C75.1 C76.1 C77.1 C78.1 C79.1 C80.1 C81.1 C82.1 C83.1 C84.1 C85.1 C149.1 C150.1 C151.1 C152.1 C153.1 C154.1 C155.1 C156.1 C157.1 C158.1 C159.1 C160.1 C161.1 U1.G8(VCCPINT) U1.H9(VCCPINT) U1.H11(VCCBRAM) U1.J8(VCCPINT) U1.J10(VCCBRAM) U1.J12(VCCINT) U1.J14(VCCINT) U1.K13(VCCINT) U1.L8(VCCPINT) U1.L14(VCCINT) U1.M13(VCCINT) U1.N8(VCCPINT) U1.N14(VCCINT) U1.P13(VCCINT) U1.R8(VCCPINT) U1.R14(VCCINT)
VCC1V8: C86.1 C87.1 C88.1 C89.1 C90.1 C91.1 C92.1 C108.1 C109.1 C110.1 C111.1 C112.1 C113.1 C114.1 C115.1 U1.G9(VCCBATT_0) U1.K9(VCCPAUX) U1.L10(VCCAUX) U1.M9(VCCPAUX) U1.N10(VCCAUX) U1.P9(VCCPAUX) U1.P11(VCCAUX) U1.R10(VCCAUX) U1.T9(VCCPAUX)
VCC3V3: C93.1 C94.1 C95.1 C96.1 C97.1 C98.1 C99.1 C100.1 C101.1 C102.1 C103.1 C104.1 C105.1 C106.1 C107.1 C116.1 C117.1 C118.1 C119.1 C120.1 C121.1 C122.1 C123.1 C124.1 C125.1 C126.1 C127.1 C128.1 C129.1 C130.1 C131.1 C132.1 C133.1 C134.1 C135.1 C136.1 C137.1 C138.1 C139.1 C140.1 C141.1 C142.1 C143.1 C144.1 C145.1 C146.1 C147.1 C148.1 P1.2 R31.2 R32.2 R33.2 R34.2 R39.1 R40.1 U1.A10(VCCO_MIO1_501) U1.A20(VCCO_35) U1.AA10(VCCO_13) U1.AA20(VCCO_33) U1.AB3(VCCO_13) U1.AB13(VCCO_33) U1.B3(VCCO_MIO0_500) U1.B13(VCCO_MIO1_501) U1.C6(VCCO_MIO0_500) U1.C16(VCCO_35) U1.D9(VCCO_MIO1_501) U1.D19(VCCO_35) U1.E12(VCCO_MIO1_501) U1.E22(VCCO_35) U1.F15(VCCO_35) U1.G18(VCCO_35) U1.H21(VCCO_35) U1.K17(VCCO_34) U1.L20(VCCO_34) U1.N16(VCCO_34) U1.P19(VCCO_34) U1.R12(VCCO_0) U1.R22(VCCO_34) U1.T5(VCCO_13) U1.T7(RSVDVCC1) U1.T8(RSVDVCC2) U1.T10(RSVDVCC3) U1.T15(VCCO_34) U1.U8(VCCO_13) U1.U18(VCCO_33) U1.V11(VCCO_13) U1.V21(VCCO_33) U1.W4(VCCO_13) U1.W14(VCCO_33) U1.Y7(VCCO_13) U1.Y17(VCCO_33)
PL_DONE: U1.T12(DONE_0)
PROG: U1.T11(PROGRAM_B_0)
PROG-RST: P1.14
TCK: R34.1 R37.1 U1.G11(TCK_0)
TCK-JTAG: P1.6 R37.2
TDI: R33.1 R35.1 U1.H13(TDI_0)
TDI-JTAG: P1.10 R35.2
TDO: R31.1 R36.1 U1.G14(TDO_0)
TDO-JTAG: P1.8 R36.2
TMS: R32.1 R38.1 U1.G12(TMS_0)
TMS-JTAG: P1.4 R38.2
VCCADC_0: U1.K11(VCCADC_0)
XADC-AGND: R44.2 U1.K12(GNDADC_0) U1.L12(VREFN_0) U1.M11(VREFP_0)
NetR39_2: R39.2 U1.T14(INIT_B_0)
NetR40_2: R40.2 R41.1 U1.T13(CFGBVS_0)
NetR42_1: R42.1 U1.N11(DXP_0)
NetR43_1: R43.1 U1.N12(DXN_0)

Not connected (* = marked no-connect by the designer): P1 12; U1 H10(VCCPLL)

### Notes on the sheet
- ZYNQ POWER AND JTAG
- (near U1) ZYNQ PWR 1
- Add filter bead and caps to VCCPLL and filter caps to VCCADC!!!!
- (near U1) ZYNQ PWR 2
- (near U1) ZYNQ JTAG
- (near P1) JTAG Header
- (near U1) ?
- ?
- ZYNQ Bypass Capacitors
- (near C56) ?
- VCCINT
- (near C71) ?
- VCCBRAM
- (near U1) ZYNQ GND
- VCCPINT
- VCCPAUX
- VCC_FPGA13
- VCCO_MIO0
- VCCAUX
- VCC_FPGA35
- VCCO_MIO1
- VCC_FPGA33
- VCC_FPGA34
- (near U1) CLOCKS (CPU & PCIE)
- VCCO_DDR_502
- CONFIDENTAL. Do not distribute.
- Variant:
- Checked by
- (in symbol SDTitleBlock) Title:; Page Contents:; Revision:; Size:; DWG NO; Date:; Sheet; of

### Library data of the parts
C56-C58 C71 C77 C86 C93 C102 C116 C125 C131 C140 C149 C150 = GRM32EE70G107ME19L: CAP CER 100UF 4V X7U 1210; Manufacturer: Murata Electronics North America; Tolerance: ±20%; Supplier 1: Digi-Key; Manufacturer Part Number: GRM32EE70G107ME19L; RoHS: RoHS Compliant; Category: Capacitors; Stock 1: 21753; Pricing 1: 1=1.45, 10=1.189, 50=1.0444, 100=0.8413, 250=0.69624, 500=0.62372 (USD); Packaging: Cut Tape (CT); Voltage - Rated: 4V; Temperature Coefficient: X7U; Mounting Type: Surface Mount, MLCC; Operating Temperature: -55°C ~ 125°C; Applications: General Purpose; Ratings: -; Package / Case: 1210 (3225 Metric); Size / Dimension: 0.126" L x 0.098" W (3.20mm x 2.50mm); Height - Seated (Max): -; Thickness (Max): 0.106" (2.70mm); Lead Spacing: -; Features: -; Lead Style: -; ComponentLink1URL: http://www.murata.com/~/media/webrenewal/support/library/catalog/products/capacitor/mlcc/c02e.pdf; ComponentLink1Description: http://www.murata.com/~/media/webrenewal/support/library/catalog/products/capacitor/mlcc/c02e.pdf; Supplier Part Number 1: 490-6534-1-ND
C59-C63 C72 C73 C78-C80 C87 C88 C94-C96 C103 C104 C109 C110 C117-C119 C126 C127 C132-C134 C141-C143 C151-C154 = GRM188R60J475KE19D: CAP CER 4.7UF 6.3V X5R 0603; Manufacturer: Murata Electronics North America; Tolerance: ±10%; Supplier 1: Digi-Key; Manufacturer Part Number: GRM188R60J475KE19D; RoHS: RoHS Compliant; Category: Capacitors; Stock 1: 670646; Pricing 1: 1=0.12, 10=0.08, 50=0.046, 100=0.038, 250=0.032, 500=0.0268, 1000=0.022 (USD); Packaging: Cut Tape (CT); Voltage - Rated: 6.3V; Temperature Coefficient: X5R; Mounting Type: Surface Mount, MLCC; Operating Temperature: -55°C ~ 85°C; Applications: General Purpose; Ratings: -; Package / Case: 0603 (1608 Metric); Size / Dimension: 0.063" L x 0.031" W (1.60mm x 0.80mm); Height - Seated (Max): -; Thickness (Max): 0.035" (0.90mm); Lead Spacing: -; Features: -; Lead Style: -; ComponentLink1URL: http://www.murata.com/~/media/webrenewal/support/library/catalog/products/capacitor/mlcc/c02e.pdf; ComponentLink1Description: http://www.murata.com/~/media/webrenewal/support/library/catalog/products/capacitor/mlcc/c02e.pdf; Supplier Part Number 1: 490-3297-1-ND
C64-C70 C74-C76 C81-C85 C89-C92 C97-C101 C105-C107 C111-C115 C120-C124 C128-C130 C135-C139 C144-C148 C155-C161 = C1005X7S1A474K050BC: CAP CER 0.47UF 10V X7S 0402; Manufacturer: TDK Corporation; Tolerance: ±10%; Supplier 1: Digi-Key; Manufacturer Part Number: C1005X7S1A474K050BC; RoHS: RoHS Compliant; Category: Capacitors; Stock 1: 209830; Pricing 1: 1=0.13, 10=0.09, 100=0.0428, 250=0.036, 500=0.03016, 1000=0.02475, 5000=0.02093 (USD); Packaging: Cut Tape (CT); Voltage - Rated: 10V; Temperature Coefficient: X7S; Mounting Type: Surface Mount, MLCC; Operating Temperature: -55°C ~ 125°C; Applications: General Purpose; Ratings: -; Package / Case: 0402 (1005 Metric); Size / Dimension: 0.039" L x 0.020" W (1.00mm x 0.50mm); Height - Seated (Max): -; Thickness (Max): -; Lead Spacing: -; Features: -; Lead Style: -; ComponentLink1URL: https://product.tdk.com/info/en/catalog/datasheets/mlcc_commercial_general_en.pdf; ComponentLink1Description: https://product.tdk.com/info/en/catalog/datasheets/mlcc_commercial_general_en.pdf; Supplier Part Number 1: 445-8009-1-ND
C108 = GRM32ER61C476ME15L: CAP CER 47UF 16V X5R 1210; Manufacturer: Murata Electronics North America; Tolerance: ±20%; Supplier 1: Digi-Key; Manufacturer Part Number: GRM32ER61C476ME15L; RoHS: RoHS Compliant; Category: Capacitors; Stock 1: 466196; Pricing 1: 1=0.94, 10=0.795, 50=0.585, 100=0.465, 250=0.39, 500=0.3525 (USD); Packaging: Cut Tape (CT); Voltage - Rated: 16V; Temperature Coefficient: X5R; Mounting Type: Surface Mount, MLCC; Operating Temperature: -55°C ~ 85°C; Applications: General Purpose; Ratings: -; Package / Case: 1210 (3225 Metric); Size / Dimension: 0.126" L x 0.098" W (3.20mm x 2.50mm); Height - Seated (Max): -; Thickness (Max): 0.106" (2.70mm); Lead Spacing: -; Features: -; Lead Style: -; ComponentLink1URL: http://www.murata.com/~/media/webrenewal/support/library/catalog/products/capacitor/mlcc/c02e.pdf; ComponentLink1Description: http://www.murata.com/~/media/webrenewal/support/library/catalog/products/capacitor/mlcc/c02e.pdf; Supplier Part Number 1: 490-3888-1-ND
P1 = 0878311420: CONN HEADER 14POS 2MM VERT GOLD; Manufacturer: Molex, LLC; Connector Type: Header, Shrouded; Number of Positions: 14; Number of Positions Loaded: All; Pitch: 0.079" (2.00mm); Supplier 1: Digi-Key; Manufacturer Part Number: 0878311420; RoHS: RoHS Compliant; Category: Connectors, Interconnects; Stock 1: 15469; Pricing 1: 1=1.37, 10=1.239, 25=1.1632, 50=1.1126, 100=1.062, 250=0.96084, 500=0.88498, 1000=0.75855, 2500=0.70798 (USD); Packaging: Tube; Contact Type: Male Pin; Number of Rows: 2; Row Spacing: 0.079" (2.00mm); Contact Mating Length: 0.141" (3.60mm); Mounting Type: Through Hole; Termination: Solder; Fastening Type: -; Features: -; Contact Finish: Gold; Contact Finish Thickness: 15µin (0.38µm); Color: Black; ComponentLink1URL: http://www.molex.com/pdm_docs/sd/878311420_sd.pdf; ComponentLink1Description: http://www.molex.com/pdm_docs/sd/878311420_sd.pdf; Supplier Part Number 1: WM17469-ND
R31-R34 R39 = ERJ-3EKF4701V: RES SMD 4.7K OHM 1% 1/10W 0603; Manufacturer: Panasonic Electronic Components; Power (Watts): 0.1W, 1/10W; Temperature Coefficient: ±100ppm/°C; Supplier 1: Digi-Key; Manufacturer Part Number: ERJ-3EKF4701V; RoHS: RoHS Compliant; Category: Resistors; Stock 1: 3227786; Pricing 1: 1=0.1, 50=0.0114, 100=0.0084, 250=0.00644, 500=0.00514, 1000=0.00379 (USD); Packaging: Cut Tape (CT); Tolerance: ±1%; Composition: Thick Film; Features: Automotive AEC-Q200; Operating Temperature: -55°C ~ 155°C; Package / Case: 0603 (1608 Metric); Supplier Device Package: 0603; Size / Dimension: 0.063" L x 0.031" W (1.60mm x 0.80mm); Height: 0.022" (0.55mm); Number of Terminations: 2; ComponentLink1URL: http://industrial.panasonic.com/www-cgi/jvcr13pz.cgi?E+PZ+3+AOA0002+ERJ3EKF4701V+7+WW; ComponentLink1Description: http://industrial.panasonic.com/www-cgi/jvcr13pz.cgi?E+PZ+3+AOA0002+ERJ3EKF4701V+7+WW; Supplier Part Number 1: P4.70KHCT-ND
R35-R38 = RC0603FR-07100RL: RES SMD 100 OHM 1% 1/10W 0603; Manufacturer: Yageo; Power (Watts): 0.1W, 1/10W; Temperature Coefficient: ±100ppm/°C; Supplier 1: Digi-Key; Manufacturer Part Number: RC0603FR-07100RL; RoHS: RoHS Compliant; Category: Resistors; Stock 1: 2614734; Pricing 1: 1=0.1, 10=0.014, 25=0.01, 100=0.0057, 250=0.00436, 500=0.00348, 1000=0.00257, 2500=0.00223 (USD); Packaging: Cut Tape (CT); Tolerance: ±1%; Composition: Thick Film; Features: Moisture Resistant; Operating Temperature: -55°C ~ 155°C; Package / Case: 0603 (1608 Metric); Supplier Device Package: 0603; Size / Dimension: 0.063" L x 0.031" W (1.60mm x 0.80mm); Height: 0.022" (0.55mm); Number of Terminations: 2; ComponentLink1URL: http://www.yageo.com/NewPortal/yageodocoutput?fileName=/pdf/R-Chip/PYu-RC_Group_51_RoHS_L_3.pdf; ComponentLink1Description: http://www.yageo.com/NewPortal/yageodocoutput?fileName=/pdf/R-Chip/PYu-RC_Group_51_RoHS_L_3.pdf; Supplier Part Number 1: 311-100HRCT-ND
R40 R42 R43 = RC0603FR-0710KL: RES SMD 10K OHM 1% 1/10W 0603; Manufacturer: Yageo; Power (Watts): 0.1W, 1/10W; Temperature Coefficient: ±100ppm/°C; Supplier 1: Digi-Key; Manufacturer Part Number: RC0603FR-0710KL; RoHS: RoHS Compliant; Category: Resistors; Stock 1: 16651166; Pricing 1: 1=0.1, 10=0.014, 25=0.01, 100=0.0057, 250=0.00436, 500=0.00348, 1000=0.00257, 2500=0.00223 (USD); Packaging: Cut Tape (CT); Tolerance: ±1%; Composition: Thick Film; Features: Moisture Resistant; Operating Temperature: -55°C ~ 155°C; Package / Case: 0603 (1608 Metric); Supplier Device Package: 0603; Size / Dimension: 0.063" L x 0.031" W (1.60mm x 0.80mm); Height: 0.022" (0.55mm); Number of Terminations: 2; ComponentLink1URL: http://www.yageo.com/NewPortal/yageodocoutput?fileName=/pdf/R-Chip/PYu-RC_Group_51_RoHS_L_3.pdf; ComponentLink1Description: http://www.yageo.com/NewPortal/yageodocoutput?fileName=/pdf/R-Chip/PYu-RC_Group_51_RoHS_L_3.pdf; Supplier Part Number 1: 311-10.0KHRCT-ND
R41 R44 = ERJ-3GEY0R00V: RES SMD 0.0OHM JUMPER 1/10W 0603; Manufacturer: Panasonic Electronic Components; Power (Watts): 0.1W, 1/10W; Supplier 1: Digi-Key; Manufacturer Part Number: ERJ-3GEY0R00V; RoHS: RoHS Compliant; Category: Resistors; Stock 1: 7608993; Pricing 1: 1=0.1, 50=0.0126, 100=0.0096, 250=0.00716, 500=0.00528, 1000=0.00352, 2500=0.00297 (USD); Packaging: Cut Tape (CT); Tolerance: Jumper; Composition: Thick Film; Features: Automotive AEC-Q200; Temperature Coefficient: -; Operating Temperature: -55°C ~ 155°C; Package / Case: 0603 (1608 Metric); Supplier Device Package: 0603; Size / Dimension: 0.063" L x 0.031" W (1.60mm x 0.80mm); Height: 0.022" (0.55mm); Number of Terminations: 2; ComponentLink1URL: http://industrial.panasonic.com/www-cgi/jvcr13pz.cgi?E+PZ+3+AOA0001+ERJ3GEY0R00V+7+WW; ComponentLink1Description: http://industrial.panasonic.com/www-cgi/jvcr13pz.cgi?E+PZ+3+AOA0001+ERJ3GEY0R00V+7+WW; Supplier Part Number 1: P0.0GCT-ND
U1 = XC7Z020-1CLG484I: IC SOC CORTEX-A9 ARTIX-7 484BGA; Manufacturer: Xilinx Inc.; Architecture: MCU, FPGA; Core Processor: Dual ARM® Cortex®-A9 MPCore™ with CoreSight™; MCU RAM: 256KB; Peripherals: DMA; Connectivity: CAN, EBI/EMI, Ethernet, I²C, MMC/SD/SDIO, SPI, UART/USART, USB OTG; Speed: 667MHz; Primary Attributes: Artix™-7 FPGA, 85K Logic Cells; Number of I/O: 130; Supplier 1: Digi-Key; Manufacturer Part Number: XC7Z020-1CLG484I; RoHS: RoHS Compliant; Category: Integrated Circuits (ICs); Stock 1: 188; Pricing 1: 1=128.75 (USD); Packaging: Tray; MCU Flash: -; Operating Temperature: -40°C ~ 100°C; Package / Case: 484-LFBGA, CSPBGA; Supplier Device Package: 484-CSPBGA (19x19); ComponentLink1URL: http://www.xilinx.com/support/documentation/data_sheets/ds190-Zynq-7000-Overview.pdf; ComponentLink1Description: http://www.xilinx.com/support/documentation/data_sheets/ds190-Zynq-7000-Overview.pdf; Supplier Part Number 1: 122-1849-ND